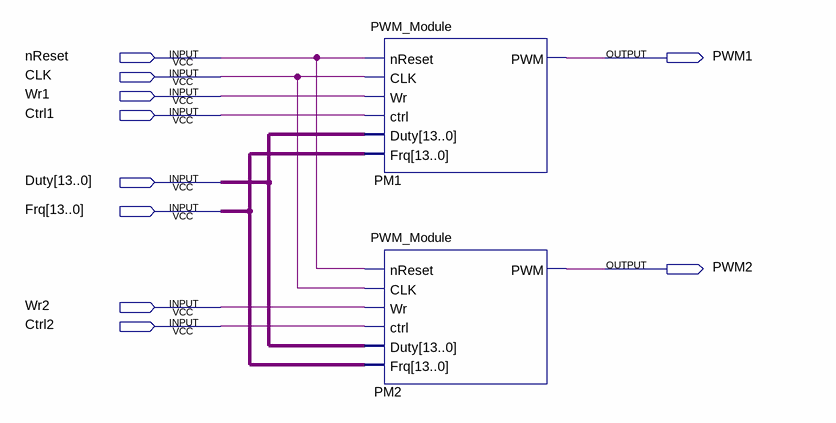
[diagram p0: schematic sheet]
// Quartus schematic PWMblock.bdf as structural Verilog: 2 symbols, 10 pins
module PWMblock (
  input  nReset,
  input  CLK,
  input  Wr1,
  input  Ctrl1,
  input  [13:0] Duty,
  input  [13:0] Frq,
  input  Wr2,
  input  Ctrl2,
  output PWM1,
  output PWM2
);

  PWM_Module PM1 (.nReset(nReset), .CLK(CLK), .Wr(Wr1), .ctrl(Ctrl1), .Duty(Duty), .Frq(Frq), .PWM(PWM1));
  PWM_Module PM2 (.nReset(nReset), .CLK(CLK), .Wr(Wr2), .ctrl(Ctrl2), .Duty(Duty), .Frq(Frq), .PWM(PWM2));
endmodule
